# Altium project eeg-measurement-circuit.PrjPcb (part 3 of 3)

## Sheet Interface.SchDoc: EEG Measurement Circuit
size A2; Date: 24/01/2025; DrawnBy: Giang Phan Truong; SheetNumber: 7; SheetTotal: 7
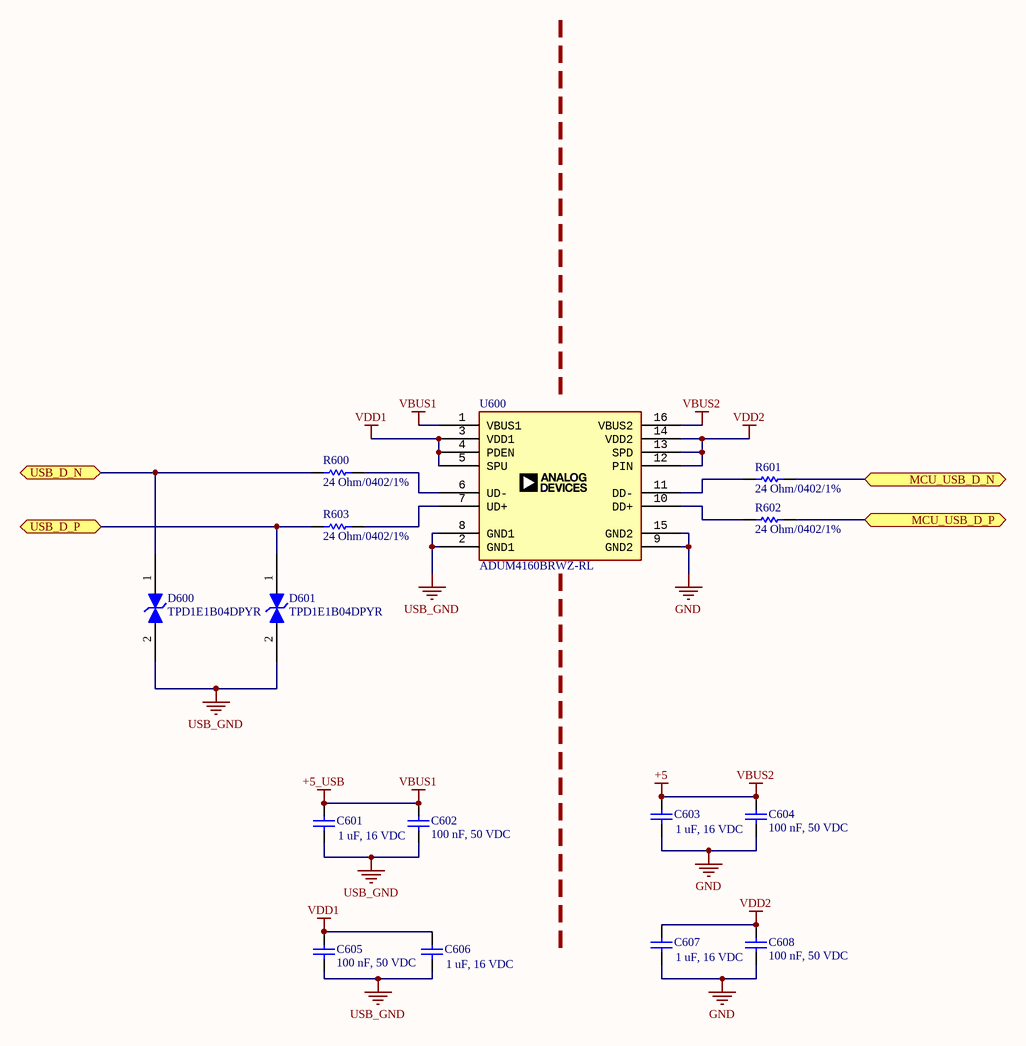
[diagram p6: Interface.SchDoc]

### Parts
C601  1 uF, 16 VDC  [CAP_0603]
C602  100 nF, 50 VDC  [CAP_0603]
C603  1 uF, 16 VDC  [CAP_0603]
C604  100 nF, 50 VDC  [CAP_0603]
C605  100 nF, 50 VDC  [CAP_0603]
C606  1 uF, 16 VDC  [CAP_0603]
C607  1 uF, 16 VDC  [CAP_0603]
C608  100 nF, 50 VDC  [CAP_0603]
D600  TPD1E1B04DPYR  [DIO_TPD1E05U06DPYR]
D601  TPD1E1B04DPYR  [DIO_TPD1E05U06DPYR]
R600  value 24 Ohm/0402/1%  [R0402]  (hidden comment: Resistor 24 Ohm 0402 1%)
R601  value 24 Ohm/0402/1%  [R0402]  (hidden comment: Resistor 24 Ohm 0402 1%)
R602  value 24 Ohm/0402/1%  [R0402]  (hidden comment: Resistor 24 Ohm 0402 1%)
R603  value 24 Ohm/0402/1%  [R0402]  (hidden comment: Resistor 24 Ohm 0402 1%)
U600  ADUM4160BRWZ-RL  [SOIC16]

### Ports
MCU_USB_D_N (bidir, see Block Diagram[6B], Digital Processing[2B]), MCU_USB_D_P (bidir, see Block Diagram[6B], Digital Processing[2B]), USB_D_N (bidir, see Block Diagram[7B], Power Supplies[2A]), USB_D_P (bidir, see Block Diagram[7B], Power Supplies[2A])

### Nets
+5: C603.2 C604.1 U600.16(VBUS2)  [also labelled VBUS2]
+5_USB: C601.2 C602.1 U600.1(VBUS1)  [also labelled VBUS1]
GND: C603.1 C604.2 C607.1 C608.2 U600.9(GND2) U600.15(GND2)
USB_GND: C601.1 C602.2 C605.2 C606.1 D600.2 D601.2 U600.2(GND1) U600.8(GND1)
VDD1: C605.1 C606.2 U600.3(VDD1) U600.4(PDEN) U600.5(SPU)
VDD2: C607.2 C608.1 U600.12(PIN) U600.13(SPD) U600.14(VDD2)
MCU_USB_D_N: R601.2 ; port MCU_USB_D_N
MCU_USB_D_P: R602.2 ; port MCU_USB_D_P
USB_D_N: D600.1 R600.1 ; port USB_D_N
USB_D_P: D601.1 R603.1 ; port USB_D_P
NetR600_2: R600.2 U600.6(UD-)
NetR601_1: R601.1 U600.11(DD-)
NetR602_1: R602.1 U600.10(DD+)
NetR603_2: R603.2 U600.7(UD+)

### Notes on the sheet
- Project Name:
- Date:
- Size
- Size:
- A2
- Last Modified:
- Revision:
- Drawn By:
- File:
- Checked By:
- Sheet
- of

### Library data of the parts
C601 C603 C606 C607 = 0106031051016: CAP, size 0603, 1 uF, 16 VDC; Manufacture Name: Samsung Electro-Mechanics; Manufacture SN: CL10B105KO8NNWC; Capacitance: 1 uF; Tolerance: +/-10%; Voltage Rating DC: 16 VDC; Operating Temperature: -55 to +125degC; Packaging: Tape and Reel; Mounting Technology: SMT; Size: 0603; Supplier 1 Name: Mouser; Supplier 1 SN: 187-CL10B105KO8NNWC; Supplier 1 URL: https://www.mouser.vn/ProductDetail/Samsung-Electro-Mechanics/CL10B105KO8NNWC?qs=81r%252BiQLm7BT%252BXtc72qn1ug%3D%3D&utm_source=mouser-refine-download&utm_medium=file&utm_campaign=CL10B105KO8NNWC&utm_content=Samsung-Electro-Mechanics; Supplier 2 Name: Digi-Key; Supplier 2 SN: 1276-CL10B105KO8NNWCTR-ND; Supplier 2 URL: https://www.digikey.com/en/products/detail/samsung-electro-mechanics/cl10b105ko8nnwc/16572783; Supplier 3 Name: thegioiic; Supplier 3 SN: N/A; Supplier 3 URL: https://www.thegioiic.com/tu-gom-0603-1uf-16v; Value: 1 uF, 16 VDC; Buy: https://tme.vn/Product.aspx?id=728#page=pro_info
C602 C604 C605 C608 = 0106031041050: CAP, size 0603, 100 nF, 50 VDC; Manufacture Name: TDK; Manufacture SN: CGA3E3X8R1H104K080AE; Capacitance: 100 nF; Tolerance: +/-10%; Voltage Rating DC: 50 VDC; ComponentLink2Description: Datasheet; ComponentLink2URL: https://product.tdk.com/system/files/dam/doc/product/capacitor/ceramic/mlcc/catalog/mlcc_automotive_soft_en.pdf?ref_disty=mouser; Operating Temperature: -55 to +125degC; Packaging: Tape and Reel; Mounting Technology: SMT; Size: 0603; Supplier 1 Name: Mouser; Supplier 1 SN: 810-CGA3E3X8R1H104KA; Supplier 1 URL: https://www.mouser.com/ProductDetail/TDK/CGA3E3X8R1H104K080AE?qs=nQSIdc08i%252Bd8g3IRRgU2bw%3D%3D&utm_source=mouser-refine-download&utm_medium=file&utm_campaign=CGA3E3X8R1H104K080AE&utm_content=TDK; Supplier 2 Name: Digi-Key; Supplier 2 SN: 445-173697-2-ND; Supplier 2 URL: https://www.digikey.com/en/products/detail/tdk-corporation/cga3e3x8r1h104k080ae/5809262; Supplier 3 Name: thegioiic; Supplier 3 SN: N/A; Supplier 3 URL: N/A; Value: 100 nF, 50 VDC; Buy: https://tme.vn/Product.aspx?id=739#page=pro_info
D600 D601 = TPD1E1B04DPYR: 8.5V (Typ) Clamp 6.3A (8/20µs) Ipp Tvs Diode Surface Mount 2-X1SON (1x.60); MF: Texas Instruments; Mouser-Purchase-URL: https://snapeda.com/shop?store=Mouser&id=616615; Price: None; Availability: Warning; SnapEDA_Link: https://www.snapeda.com/parts/TPD1E1B04DPYR/Texas%20Instruments/view-part/616615/?ref=snap; Texas_Instruments-Purchase-URL: https://snapeda.com/shop?store=Texas+Instruments&id=616615; Package: X1SON-2 Texas Instruments; MP: TPD1E1B04DPYR; Value: TPD1E1B04DPYR
R600-R603 = Resistor 24 Ohm 0402 1%: 1/16W Thick Film Resistors 50V ±5% ±200ppm/℃ 24Ω 0402 Chip Resistor - Surface Mount ROHS; Buy: https://www.lcsc.com/product-detail/Chip-Resistor-Surface-Mount_FH-Guangdong-Fenghua-Advanced-Tech-RC-02W240JT_C258123.html?s_z=n_24%2520Ohm
U600 = ADUM4160BRWZ-RL: USB Digital Isolator 5000Vrms 1 Channel 12Mbps 25kV/µs CMTI 16-SOIC (0.295", 7.50mm Width); Buy: https://www.lcsc.com/product-detail/Isolated-USB-ICs_Analog-Devices-ADUM4160BRWZ-RL_C57791.html; Value: ADUM4160BRWZ-RL

## Sheet Patient Protection.SchDoc: EEG Measurement Circuit
size A3; Date: 24/01/2025; DrawnBy: Giang Phan Truong; SheetNumber: 3; SheetTotal: 7
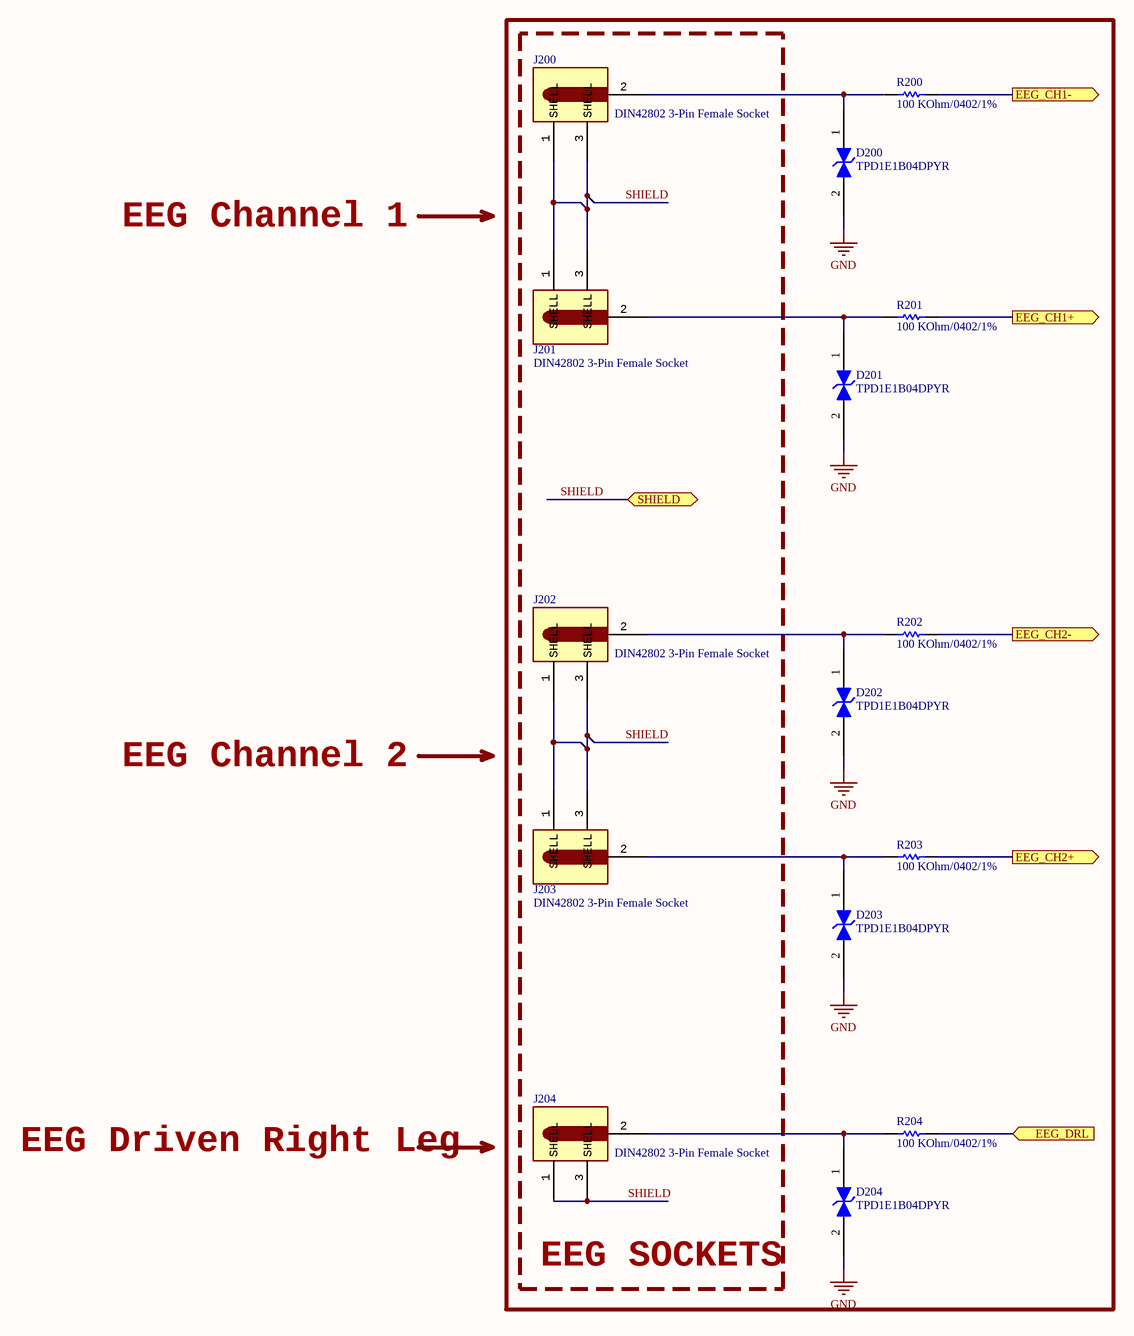
[diagram p7: Patient Protection.SchDoc]

### Parts
D200  TPD1E1B04DPYR  [DIO_TPD1E05U06DPYR]
D201  TPD1E1B04DPYR  [DIO_TPD1E05U06DPYR]
D202  TPD1E1B04DPYR  [DIO_TPD1E05U06DPYR]
D203  TPD1E1B04DPYR  [DIO_TPD1E05U06DPYR]
D204  TPD1E1B04DPYR  [DIO_TPD1E05U06DPYR]
J200  value DIN42802 3-Pin Female Socket  [DIN42802-1.5MM SOCKET]  (hidden comment: DIN42802 1.5mm)
J201  value DIN42802 3-Pin Female Socket  [DIN42802-1.5MM SOCKET]  (hidden comment: DIN42802 1.5mm)
J202  value DIN42802 3-Pin Female Socket  [DIN42802-1.5MM SOCKET]  (hidden comment: DIN42802 1.5mm)
J203  value DIN42802 3-Pin Female Socket  [DIN42802-1.5MM SOCKET]  (hidden comment: DIN42802 1.5mm)
J204  value DIN42802 3-Pin Female Socket  [DIN42802-1.5MM SOCKET]  (hidden comment: DIN42802 1.5mm)
R200  value 100 KOhm/0402/1%  [R0402]  (hidden comment: Resistor 100 KOhm 0402 1%)
R201  value 100 KOhm/0402/1%  [R0402]  (hidden comment: Resistor 100 KOhm 0402 1%)
R202  value 100 KOhm/0402/1%  [R0402]  (hidden comment: Resistor 100 KOhm 0402 1%)
R203  value 100 KOhm/0402/1%  [R0402]  (hidden comment: Resistor 100 KOhm 0402 1%)
R204  value 100 KOhm/0402/1%  [R0402]  (hidden comment: Resistor 100 KOhm 0402 1%)

### Blocks framed on the sheet
EEG SOCKETS: J200-J204

### Ports
EEG_CH1+ (out, see Block Diagram[3B], EEG Preprocessing[1A]), EEG_CH1- (out, see Block Diagram[3B], EEG Preprocessing[1A]), EEG_CH2+ (out, see Block Diagram[3B], EEG Preprocessing[1B]), EEG_CH2- (out, see Block Diagram[3B], EEG Preprocessing[1B]), EEG_DRL (in, see Block Diagram[3B], EEG Preprocessing[3C]), SHIELD (bidir, see Block Diagram[3B], ADC[3B], EEG Preprocessing[5C])

### Nets
GND: D200.2 D201.2 D202.2 D203.2 D204.2
SHIELD: J200.1(SHELL) J200.3(SHELL) J201.1(SHELL) J201.3(SHELL) J202.1(SHELL) J202.3(SHELL) J203.1(SHELL) J203.3(SHELL) J204.1(SHELL) J204.3(SHELL) ; port SHIELD
NetC300_2: R201.2 ; port EEG_CH1+
NetC303_1: R200.2 ; port EEG_CH1-
NetC309_2: R203.2 ; port EEG_CH2+
NetC312_1: R202.2 ; port EEG_CH2-
NetC318_1: R204.2 ; port EEG_DRL
NetD200_1: D200.1 J200.2(PORT) R200.1
NetD201_1: D201.1 J201.2(PORT) R201.1
NetD202_1: D202.1 J202.2(PORT) R202.1
NetD203_1: D203.1 J203.2(PORT) R203.1
NetD204_1: D204.1 J204.2(PORT) R204.1

### Notes on the sheet
- EEG Channel 1
- EEG Channel 2
- EEG Driven Right Leg
- Project Name:
- Size
- Size:
- A3
- Revision:
- Drawn By:
- Date:
- File:
- Last Modified:
- Checked By:
- Sheet
- of

### Library data of the parts
D200-D204 = TPD1E1B04DPYR: as D600 on sheet Interface; Mouser-Purchase-URL: https://snapeda.com/shop?store=Mouser&id=616615; Price: None; Availability: Warning; SnapEDA_Link: https://www.snapeda.com/parts/TPD1E1B04DPYR/Texas%20Instruments/view-part/616615/?ref=snap; Texas_Instruments-Purchase-URL: https://snapeda.com/shop?store=Texas+Instruments&id=616615; Package: X1SON-2 Texas Instruments; MP: TPD1E1B04DPYR; Value: TPD1E1B04DPYR
J200-J204 = DIN42802 1.5mm: 3 PIN Socket Female Socket for PCB EEG EMG DIN42802 1.5 mm Connector; ComponentLink1Description: Buy; ComponentLink1URL: https://www.alibaba.com/product-detail/3-PIN-Socket-Female-Socket-for_62497934533.html?chatToken=TDFKeWNGRlpkWFZTWmtkNFRYRnZjVWxhVTBsU2RVcHNkRVpKVTJsMlRteERiM0ZyWlhrM2VHMXhZeTkwTVVSb2RIQnFRMGxKTmtONE9GSllWWFFyVGtka2JsY3ZLMjB6UVdnMmRsaGxWbVZpU2xFNU5HeHRNWHBhVjJNdmFXcHlSelp0VHpKc01sVnFjMGRSYUZSbkwwRm9SM0ZJYjNSd1UxVTFORmszTUhKcGRERnVaVnBHVjJsaVQwdFRTRGx6WnpCcFVURnhXbWRsZHl0UU56bE5NRkJsVjBnelNXRjZibkJGUFE9PSZ2ZXJzaW9uPTIuMC4w&encryptTargetLoginId=8pctgRBMALPo2t4oyiyajgkFqFUijPBH6wdkfYSa%2Bs4%3D
R200-R204 = Resistor 100 KOhm 0402 1%: Code 104, 1/16W 1%; ComponentLink1Description: Buy; ComponentLink1URL: https://www.thegioiic.com/dien-tro-100-kohm-0402-1-

## Nets that join several sheets
+2.5: Power Supplies (5 pins), EEG Preprocessing (18 pins), ADC (24 pins)
+3.3: Power Supplies (6 pins), ADC (13 pins), Digital Processing (22 pins)
+5: Power Supplies (6 pins), Interface (C603.2 C604.1 U600.16)
+5_USB: Power Supplies (5 pins), Interface (C601.2 C602.1 U600.1)
-2.5: Power Supplies (R106.2 SB103.1), EEG Preprocessing (18 pins), ADC (39 pins)
GND: Power Supplies (22 pins), EEG Preprocessing (63 pins), ADC (78 pins), Digital Processing (24 pins), Interface (6 pins), Patient Protection (5 pins)
USB_GND: Power Supplies (12 pins), Interface (8 pins)
GPIO0_MODE0: ADC (D400.1 U400.12), Digital Processing (U500.19)
GPIO1_MODE1: ADC (D401.1 U400.13), Digital Processing (U500.18)
GPIO2_MODE2: ADC (D402.1 U400.14), Digital Processing (U500.17)
GPIO3_MODE3: ADC (D403.1 U400.15), Digital Processing (U500.16)
GPIO4_FILTER: ADC (D404.1 U400.11), Digital Processing (U500.22)
MCU_USB_D_N: Digital Processing (U500.33), Interface (R601.2)
MCU_USB_D_P: Digital Processing (U500.34), Interface (R602.2)
NetC300_2: EEG Preprocessing (C300.2 C302.2 C303.2 R300.2), Patient Protection (R201.2)
NetC301_2: EEG Preprocessing (C301.2 R311.2 TP301.1 U301.7), ADC (R402.1 U401.5)
NetC303_1: EEG Preprocessing (C303.1 C304.1 C306.2 R305.1), Patient Protection (R200.2)
NetC309_2: EEG Preprocessing (C309.2 C311.2 C312.2 R313.2), Patient Protection (R203.2)
NetC310_2: EEG Preprocessing (C310.2 R324.2 TP303.1 U303.7), ADC (R408.1 U402.5)
NetC312_1: EEG Preprocessing (C312.1 C313.1 C315.2 R318.1), Patient Protection (R202.2)
NetC318_1: EEG Preprocessing (C318.1 R328.1 U305.1), Patient Protection (R204.2)
NetR413_2: ADC (R413.2 U400.37), Digital Processing (U500.9)
NetR414_2: ADC (R414.2 U400.30), Digital Processing (U500.8)
NetR420_2: ADC (R420.2 U400.57), Digital Processing (U500.10)
NetU400_16: ADC (U400.16), Digital Processing (U500.12)
NetU400_17: ADC (U400.17), Digital Processing (U500.13)
NetU400_18: ADC (U400.18), Digital Processing (U500.15)
NetU400_19: ADC (U400.19), Digital Processing (U500.14)
NetU400_27: ADC (U400.27), Digital Processing (U500.43)
NetU400_28: ADC (U400.28), Digital Processing (U500.39)
NetU400_29: ADC (U400.29), Digital Processing (U500.38)
SHIELD: EEG Preprocessing (6 pins), ADC (C412.2 R412.1), Patient Protection (10 pins)
USB_D_N: Power Supplies (J100.A7 J100.B7), Interface (D600.1 R600.1)
USB_D_P: Power Supplies (J100.A6 J100.B6), Interface (D601.1 R603.1)